# EAGLE design esp32 breakout (EAGLE 7.4.0)
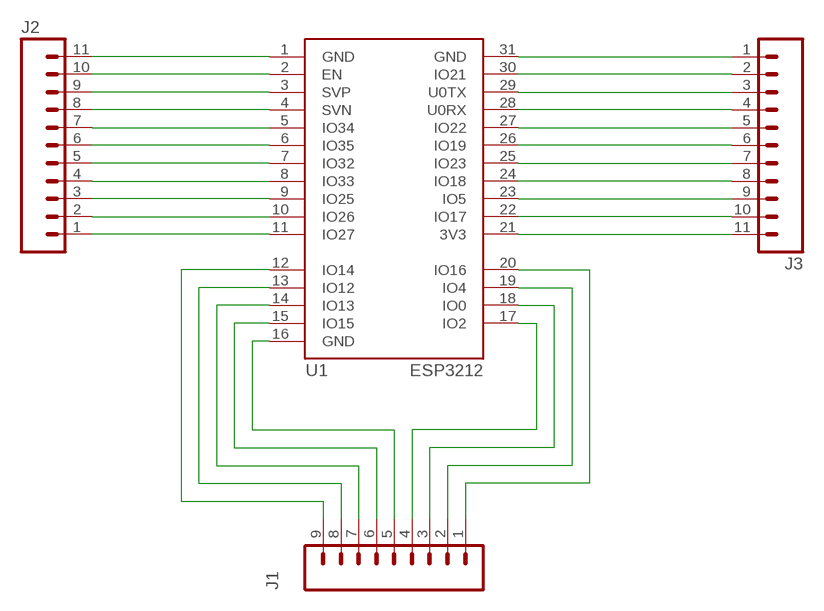
[diagram p0: schematic, sheet 1]

## Parts
J1  M09  [1X09]
J2  M11PTH  [1X11]
J3  M11PTH  [1X11]
U1  ESP3212  [ESP3212]

## Nets
N$1: J2.11 U1.1(GND)
N$2: J2.10 U1.2(EN)
N$3: J2.9 U1.3(SVP)
N$4: J2.8 U1.4(SVN)
N$5: J2.7 U1.5(IO34)
N$6: J2.6 U1.6(IO35)
N$7: J2.5 U1.7(IO32)
N$8: J2.4 U1.8(IO33)
N$9: J2.3 U1.9(IO25)
N$10: J2.2 U1.10(IO26)
N$11: J2.1 U1.11(IO27)
N$12: J1.9 U1.12(IO14)
N$13: J1.8 U1.13(IO12)
N$14: J1.7 U1.14(IO13)
N$15: J1.6 U1.15(IO15)
N$16: J1.5 U1.16(GND)
N$17: J1.4 U1.17(IO2)
N$18: J1.3 U1.18(IO0)
N$19: J1.2 U1.19(IO4)
N$20: J1.1 U1.20(IO16)
N$21: J3.1 U1.31(GND)
N$22: J3.2 U1.30(IO21)
N$23: J3.3 U1.29(U0TX)
N$24: J3.4 U1.28(U0RX)
N$25: J3.5 U1.27(IO22)
N$26: J3.6 U1.26(IO19)
N$27: J3.7 U1.25(IO23)
N$28: J3.8 U1.24(IO18)
N$29: J3.9 U1.23(IO5)
N$30: J3.10 U1.22(IO17)
N$31: J3.11 U1.21(3V3)

## Library data of the parts
J1 = SparkFun-Connectors:M09: Header 9 Standard 9-pin 0.1" header. Use with straight break away headers (SKU : PRT-00116), right angle break away headers (PRT-00553), swiss pins (PRT-00743), machine pins (PRT-00117), and female headers (PRT-00115).
J2 J3 = SparkFun-Connectors:M11: Header 11 Standard 11-pin 0.1" header. Use with straight break away headers (SKU : PRT-00116), right angle break away headers (PRT-00553), swiss pins (PRT-00743), machine pins (PRT-00117), and female headers (PRT-00115).
U1 = esp32:ESP3212: Ai-Thinker ESP3212

## Board
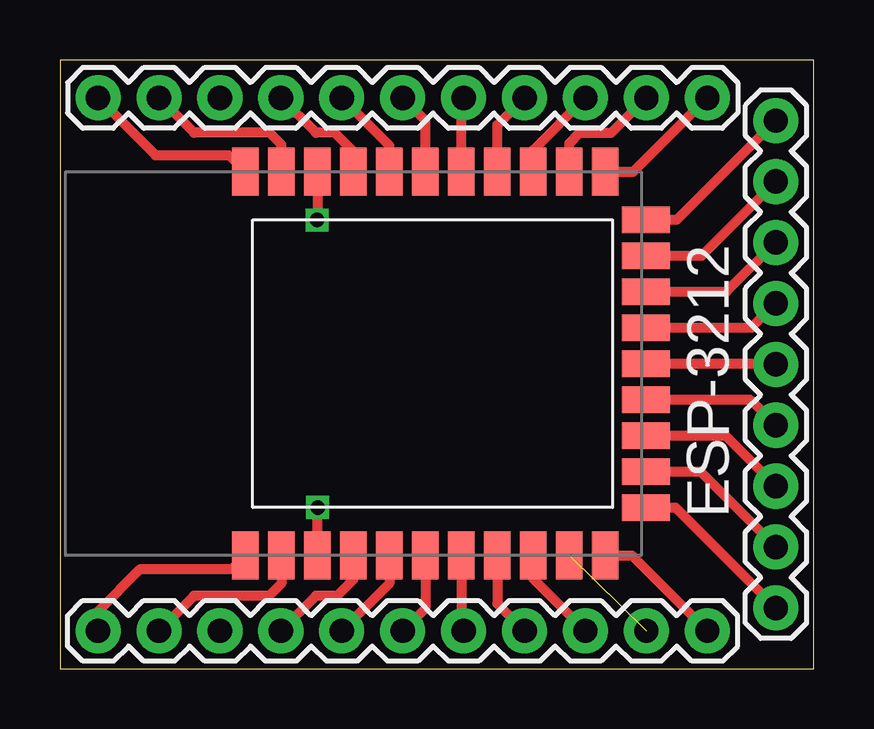
[diagram p1: board, top side]
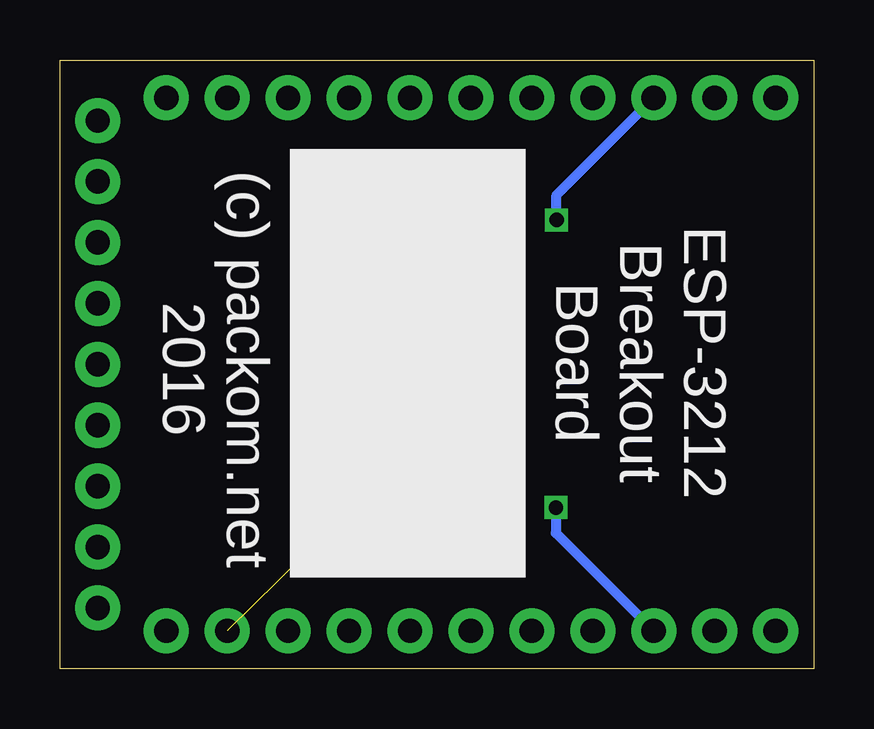
[diagram p2: board, bottom side, seen from below]

Size 31.42 x 25.39 mm. Coordinates in mm from the lower left corner, seen from the top.
Outline: 0,0 31.42,0 31.42,25.39 0,25.39 0,0
Copper layers (1*16): Top 0.0356mm / dielectric 1.5011mm / Bottom 0.0356mm
Design rules "LaenPCBOrder": minimum track width 6mil, minimum drill 13mil, track to track 6mil, track to pad 6mil, pad to pad 6mil, via to via 6mil, smd to smd 6mil, copper to edge 15mil, drill to drill 6mil, minimum pad ring 7mil, minimum via ring 7mil, stop-mask expansion 3mil, vias tented up to drill 0mil, thermal gap 10mil

### Footprints (pad centres in the part's own frame; a part is rotated, then mirrored left to right if it is on the bottom)
1X09 = drill 1.016 pad 1.88: 1 0,0; 2 2.54,0; 3 5.08,0; 4 7.62,0; 5 10.16,0; 6 12.7,0; 7 15.24,0; 8 17.78,0; 9 20.32,0
1X11 = drill 1.016 pad 1.88: 1 0,0; 2 2.54,0; 3 5.08,0; 4 7.62,0; 5 10.16,0; 6 12.7,0; 7 15.24,0; 8 17.78,0; 9 20.32,0; 10 22.86,0; 11 25.4,0
ESP3212 = smd 2 x 1.1: 1 -8,5.5; 2 -8,4; 3 -8,2.5; 4 -8,1; 5 -8,-0.5; 6 -8,-2; 7 -8,-3.5; 8 -8,-5; 9 -8,-6.5; 10 -8,-8; 11 -8,-9.5; 21 8,-9.5; 22 8,-8; 23 8,-6.5; 24 8,-5; 25 8,-3.5; 26 8,-2; 27 8,-0.5; 28 8,1; 29 8,2.5; 30 8,4; 31 8,5.5 | smd 1.1 x 2: 12 -6,-11.2; 13 -4.5,-11.2; 14 -3,-11.2; 15 -1.5,-11.2; 16 0,-11.2; 17 1.5,-11.2; 18 3,-11.2; 19 4.5,-11.2; 20 6,-11.2

### Placement (x,y rotation side)
J1  29.84,22.86 270 top
J2  26.99,1.59 180 top
J3  1.59,23.81 0 top
U1  13.23,12.73 90 top

### Tracks (layer width: path | path; a pad name or v marks a point on that pad's centre or on a via)
N$1
  Top 0.406: J2.11 1.59,2.4 3.35,4.17 7.17,4.17 U1.1
N$2
  Top 0.406: U1.2 9.23,3.57 8.71,3.05 5.59,3.05 J2.10
N$3  (via drill 0.6)
  Top 0.406: U1.3 v10.73,6.72 v10.74,6.73
  Bottom 0.406: v10.74,6.73 10.74,5.66 J2.9
N$4
  Top 0.406: U1.4 12.23,3.72 11.56,3.05 10.67,3.05 J2.8
N$5
  Top 0.406: U1.5 13.73,3.57 J2.7
N$6
  Top 0.406: U1.6 15.23,2.53 J2.6
N$7
  Top 0.406: U1.7 16.73,1.68 J2.5
N$8
  Top 0.406: U1.8 18.23,2.72 J2.4
N$9
  Top 0.406: U1.9 19.73,3.76 J2.3
N$10  (1 unrouted)
N$11
  Top 0.406: U1.11 23.85,4.72 J2.1
N$12
  Top 0.406: U1.12 25.66,6.72 J1.9
N$13
  Top 0.406: U1.13 26.7,8.22 J1.8
N$14
  Top 0.406: U1.14 27.74,9.72 J1.7
N$15
  Top 0.406: U1.15 28.78,11.22 J1.6
N$16
  Top 0.406: U1.16 29.82,12.72 J1.5
N$17
  Top 0.406: U1.17 28.83,14.22 J1.4
N$18
  Top 0.406: U1.18 27.79,15.72 J1.3
N$19
  Top 0.406: U1.19 26.75,17.23 J1.2
N$20
  Top 0.406: U1.20 25.71,18.73 J1.1
N$21
  Top 0.406: J3.1 3.99,21.41 7.05,21.41 U1.31
N$22
  Top 0.406: U1.30 9.23,21.86 8.74,22.35 5.59,22.35 J3.2
N$23  (via drill 0.6)
  Top 0.406: U1.29 10.73,18.73 v10.72,18.72
  Bottom 0.406: v10.72,18.72 10.72,19.76 J3.3
N$24
  Top 0.406: U1.28 12.23,21.57 11.46,22.35 10.67,22.35 J3.4
N$25
  Top 0.406: U1.27 13.73,21.83 J3.5
N$26
  Top 0.406: U1.26 15.23,22.87 J3.6
N$27
  Top 0.406: U1.25 16.73,23.72 J3.7
N$28
  Top 0.406: U1.24 18.23,22.68 J3.8
N$29
  Top 0.406: U1.23 19.73,21.64 J3.9
N$30
  Top 0.406: U1.22 21.23,21.92 21.67,22.35 22.99,22.35 J3.10
N$31
  Top 0.406: U1.21 23.9,20.73 J3.11

### Text on the board
tNames: ESP-3212
bNames: ESP-3212 / Breakout / Board | (c) packom.net / 2016